# EasyEDA schematic 1-Schematic_Race_project_transmitter.json
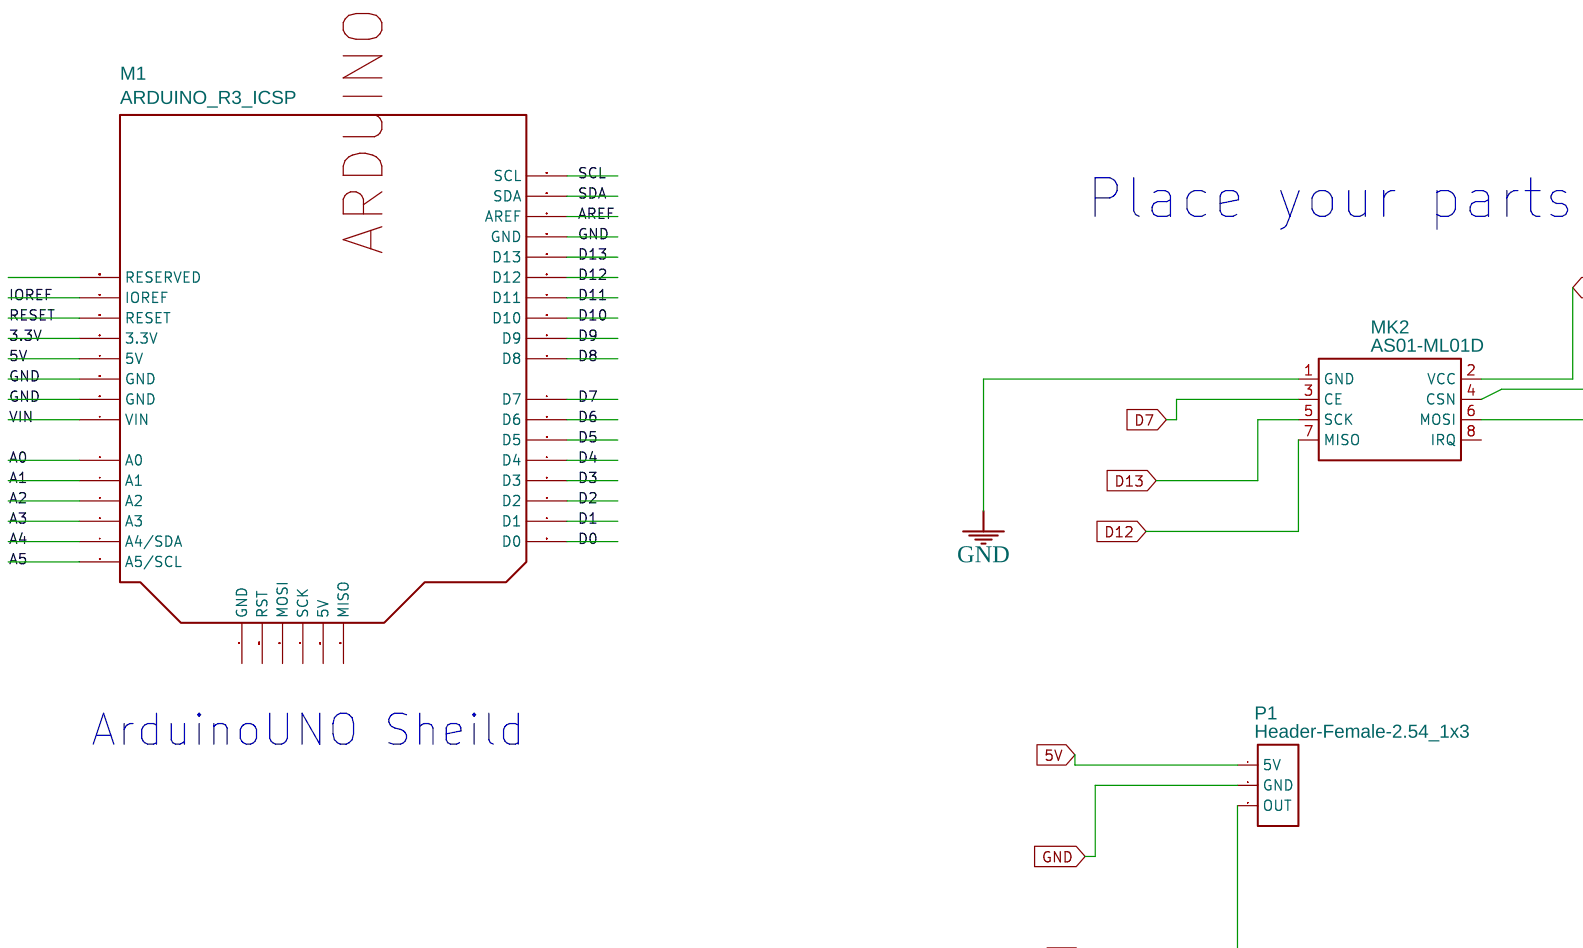
[diagram p0: schematic sheet]

## Parts
M1  ARDUINO_R3_ICSP  [ARDUINOR3_ICSP]
MK2  AS01-ML01D  [NRF24L01+]
P1  Header-Female-2.54_1x3  [HDR-3X1/2.54]

## Library data of the parts
M1 = -: catid: 20; sourceId: qGgecxTfB; Manufacturer Part: ?
MK2 = -: Supplier: LCSC; Manufacturer: Ashining; Supplier Part: C84803
P1 = -: Supplier Part: C146243; Supplier: LCSC; Manufacturer: Boom Precision Elec; link: https://datasheet.lcsc.com/szlcsc/Boom-Precision-Elec-2-54mm-1-8P-Straight-Female-header_C27438.pdf

## Nets
3.3V: M1.3.3V MK2.2(VCC)
5V: M1.5V P1.1(5V)
GND: M1.GND MK2.1(GND) P1.2(GND)
VIN: M1.VIN
A0: M1.A0 P1.3(OUT)
A1: M1.A1
A2: M1.A2
A3: M1.A3
A4: M1.A4(A4/SDA)
A5: M1.A5(A5/SCL)
AREF: M1.AREF
D0: M1.D0
D1: M1.D1
D2: M1.D2
D3: M1.D3
D4: M1.D4
D5: M1.D5
D6: M1.D6
D7: M1.D7 MK2.3(CE)
D8: M1.D8 MK2.4(CSN)
D9: M1.D9
D10: M1.D10
D11: M1.D11 MK2.6(MOSI)
D12: M1.D12 MK2.7(MISO)
D13: M1.D13 MK2.5(SCK)
IOREF: M1.IOREF
RESET: M1.RESET
SCL: M1.SCL
SDA: M1.SDA

Not connected (* = marked no-connect by the designer): M1 5V_ICSP(5V) MISO MOSI RESERVED RESET_ICSP(RST) SCK; MK2 8(IRQ)

## Notes on the sheet
- Place your parts here, start your design quickly.
- ArduinoUNO Sheild
